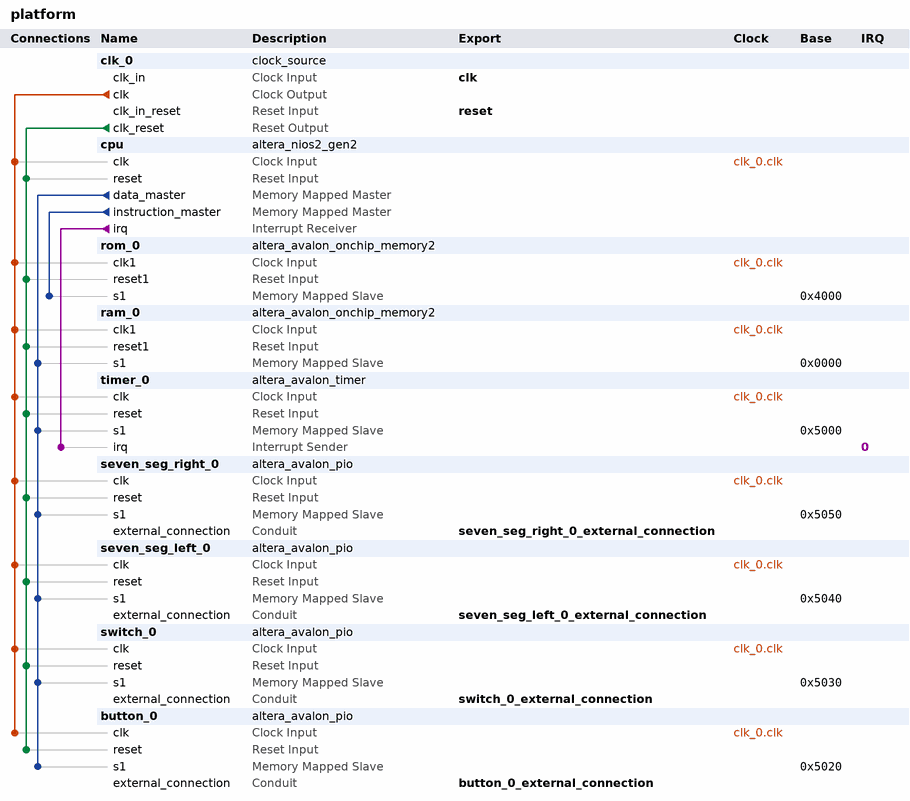
[diagram p0: system contents]
# Platform Designer (Qsys) system platform, Cyclone V 5CSEMA5F31C6
# Parameters at their usual value, and those the tool derives, are not listed.
package require -exact qsys 20.1
create_system platform
set_project_property DEVICE_FAMILY {Cyclone V}
set_project_property DEVICE 5CSEMA5F31C6

add_instance clk_0 clock_source 20.1
set_instance_parameter_value clk_0 clockFrequency 50000000

add_instance cpu altera_nios2_gen2 20.1
set_instance_parameter_value cpu dcache_size 2048
set_instance_parameter_value cpu debug_enabled false
set_instance_parameter_value cpu exceptionSlave rom_0.s1
set_instance_parameter_value cpu icache_size 4096
set_instance_parameter_value cpu impl Tiny
set_instance_parameter_value cpu resetSlave rom_0.s1

add_instance rom_0 altera_avalon_onchip_memory2 20.1
set_instance_parameter_value rom_0 dataWidth 32
set_instance_parameter_value rom_0 dualPort false
set_instance_parameter_value rom_0 initMemContent true
set_instance_parameter_value rom_0 initializationFileName onchip_mem.hex
set_instance_parameter_value rom_0 memorySize 4096
set_instance_parameter_value rom_0 writable false

add_instance ram_0 altera_avalon_onchip_memory2 20.1
set_instance_parameter_value ram_0 dataWidth 32
set_instance_parameter_value ram_0 dualPort false
set_instance_parameter_value ram_0 initMemContent true
set_instance_parameter_value ram_0 initializationFileName onchip_mem.hex
set_instance_parameter_value ram_0 memorySize 16384

add_instance timer_0 altera_avalon_timer 20.1
set_instance_parameter_value timer_0 alwaysRun true
set_instance_parameter_value timer_0 fixedPeriod true
set_instance_parameter_value timer_0 period 1
set_instance_parameter_value timer_0 periodUnits MSEC
set_instance_parameter_value timer_0 snapshot false

add_instance seven_seg_right_0 altera_avalon_pio 20.1
set_instance_parameter_value seven_seg_right_0 direction Output
set_instance_parameter_value seven_seg_right_0 width 21

add_instance seven_seg_left_0 altera_avalon_pio 20.1
set_instance_parameter_value seven_seg_left_0 direction Output
set_instance_parameter_value seven_seg_left_0 width 21

add_instance switch_0 altera_avalon_pio 20.1
set_instance_parameter_value switch_0 direction Input
set_instance_parameter_value switch_0 width 2

add_instance button_0 altera_avalon_pio 20.1
set_instance_parameter_value button_0 direction InOut
set_instance_parameter_value button_0 width 1

# connections
add_connection clk_0.clk button_0.clk clock
add_connection clk_0.clk cpu.clk clock
add_connection clk_0.clk ram_0.clk1 clock
add_connection clk_0.clk rom_0.clk1 clock
add_connection clk_0.clk seven_seg_left_0.clk clock
add_connection clk_0.clk seven_seg_right_0.clk clock
add_connection clk_0.clk switch_0.clk clock
add_connection clk_0.clk timer_0.clk clock
add_connection clk_0.clk_reset button_0.reset reset
add_connection clk_0.clk_reset cpu.reset reset
add_connection clk_0.clk_reset ram_0.reset1 reset
add_connection clk_0.clk_reset rom_0.reset1 reset
add_connection clk_0.clk_reset seven_seg_left_0.reset reset
add_connection clk_0.clk_reset seven_seg_right_0.reset reset
add_connection clk_0.clk_reset switch_0.reset reset
add_connection clk_0.clk_reset timer_0.reset reset
add_connection cpu.data_master button_0.s1 avalon
set_connection_parameter_value cpu.data_master/button_0.s1 baseAddress 0x5020
add_connection cpu.data_master ram_0.s1 avalon
set_connection_parameter_value cpu.data_master/ram_0.s1 baseAddress 0x0000
add_connection cpu.data_master seven_seg_left_0.s1 avalon
set_connection_parameter_value cpu.data_master/seven_seg_left_0.s1 baseAddress 0x5040
add_connection cpu.data_master seven_seg_right_0.s1 avalon
set_connection_parameter_value cpu.data_master/seven_seg_right_0.s1 baseAddress 0x5050
add_connection cpu.data_master switch_0.s1 avalon
set_connection_parameter_value cpu.data_master/switch_0.s1 baseAddress 0x5030
add_connection cpu.data_master timer_0.s1 avalon
set_connection_parameter_value cpu.data_master/timer_0.s1 baseAddress 0x5000
add_connection cpu.instruction_master rom_0.s1 avalon
set_connection_parameter_value cpu.instruction_master/rom_0.s1 baseAddress 0x4000
add_connection cpu.irq timer_0.irq interrupt
set_connection_parameter_value cpu.irq/timer_0.irq irqNumber 0

# exported interfaces
add_interface button_0_external_connection conduit end
set_interface_property button_0_external_connection EXPORT_OF button_0.external_connection
add_interface clk clock sink
set_interface_property clk EXPORT_OF clk_0.clk_in
add_interface reset reset sink
set_interface_property reset EXPORT_OF clk_0.clk_in_reset
add_interface seven_seg_left_0_external_connection conduit end
set_interface_property seven_seg_left_0_external_connection EXPORT_OF seven_seg_left_0.external_connection
add_interface seven_seg_right_0_external_connection conduit end
set_interface_property seven_seg_right_0_external_connection EXPORT_OF seven_seg_right_0.external_connection
add_interface switch_0_external_connection conduit end
set_interface_property switch_0_external_connection EXPORT_OF switch_0.external_connection

set_interconnect_requirement {$system} qsys_mm.clockCrossingAdapter HANDSHAKE
set_interconnect_requirement {$system} qsys_mm.enableEccProtection FALSE
set_interconnect_requirement {$system} qsys_mm.insertDefaultSlave FALSE
set_interconnect_requirement {$system} qsys_mm.maxAdditionalLatency 1

save_system platform.qsys
